# Altium project LED_GROUP.PrjPcb
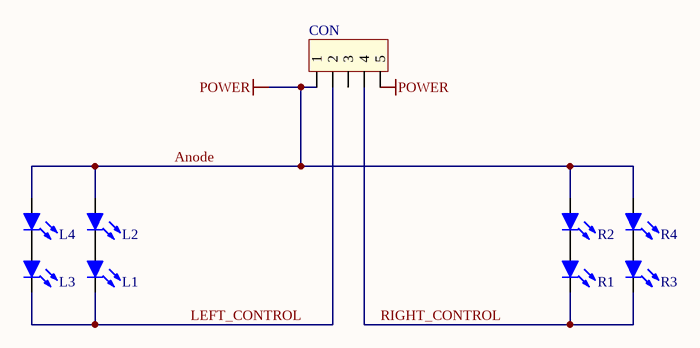
[diagram p0: LED_GROUP.SchDoc]
1 sheet, 9 parts. Net scope: global (net labels, ports and power ports of the same name join across sheets).
Board file: LED_GROUP.PcbDoc

## Sheet LED_GROUP.SchDoc
size A

### Parts
CON  Giắc XH 5P 2.54 chống cắm ngược chiều  [XH_5P_254]  (value not drawn)
L1  Mạch đèn LED bên trái  [LED OSRAM CIRCUIT]  (value not drawn)
L2  Mạch đèn LED bên trái  [LED OSRAM CIRCUIT]  (value not drawn)
L3  Mạch đèn LED bên trái  [LED OSRAM CIRCUIT]  (value not drawn)
L4  Mạch đèn LED bên trái  [LED OSRAM CIRCUIT]  (value not drawn)
R1  Mạch đèn LED bên phải  [LED OSRAM CIRCUIT]  (value not drawn)
R2  Mạch đèn LED bên phải  [LED OSRAM CIRCUIT]  (value not drawn)
R3  Mạch đèn LED bên phải  [LED OSRAM CIRCUIT]  (value not drawn)
R4  Mạch đèn LED bên phải  [LED OSRAM CIRCUIT]  (value not drawn)

### Nets
Anode: CON.1 CON.5 L2.A L4.A R2.A R4.A  [also labelled POWER]
LEFT_CONTROL: CON.2 L1.K L3.K
RIGHT_CONTROL: CON.4 R1.K R3.K
NetL1_A: L1.A L2.K
NetL3_A: L3.A L4.K
NetR1_A: R1.A R2.K
NetR3_A: R3.A R4.K

Not connected (* = marked no-connect by the designer): CON 3

### Library data of the parts
CON = Con5: Connector 5; Value: Connector 5
L1-L4 R1-R4 = Led